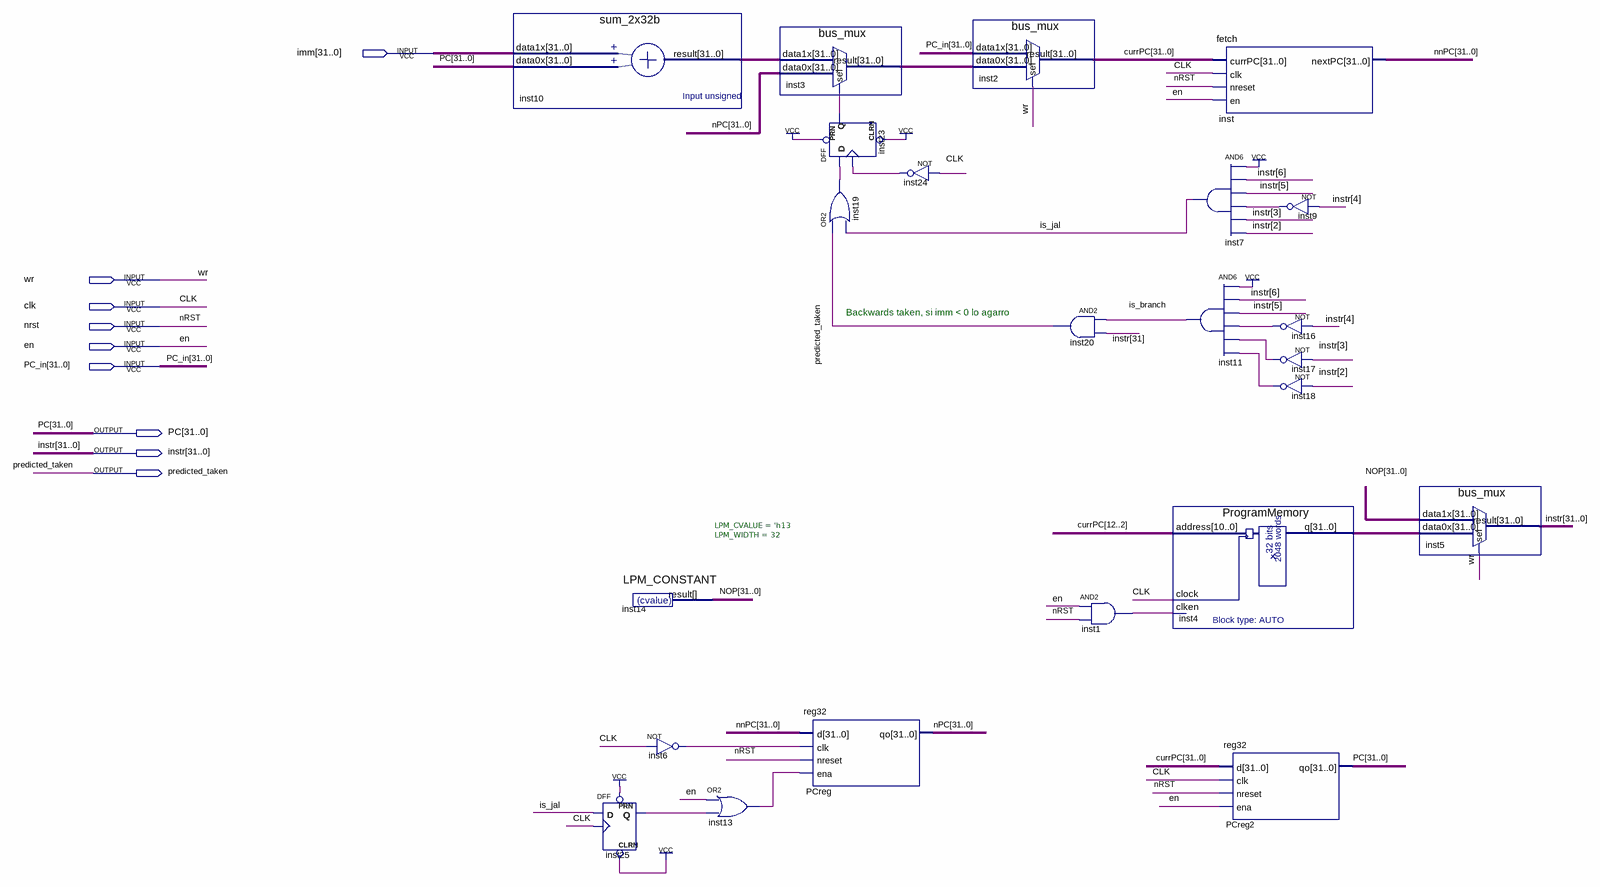
[diagram p0: schematic sheet]
// Quartus schematic IFU.bdf as structural Verilog: 23 symbols, 9 pins
module IFU (
  input  [31:0] imm,
  input  wr,
  input  clk,
  input  nrst,
  input  en,
  input  [31:0] PC_in,
  output [31:0] PC,
  output [31:0] instr,
  output predicted_taken
);

  wire inst1_out, inst6_out, inst9_out, inst13_out, inst16_out, inst17_out, inst18_out, inst19_out, inst23_q,
       inst24_out, inst25_q, is_branch, is_jal;
  wire [31:0] currPC, inst3_result, inst4_q, inst10_result, nnPC, NOP, nPC;

  sum_2x32b inst10 (.data1x(imm), .data0x(PC), .result(inst10_result));
  LPM_CONSTANT #(.LPM_CVALUE('h13), .LPM_WIDTH(32)) inst14 (.result(NOP));
  DFF inst25 (.CLRN(1'b1), .CLK(clk), .D(is_jal), .PRN(1'b1), .Q(inst25_q));
  not inst6 (inst6_out, clk);
  or inst13 (inst13_out, en, inst25_q);
  bus_mux inst3 (.data1x(inst10_result), .data0x(nPC), .sel(inst23_q), .result(inst3_result));
  reg32 PCreg (.d(nnPC), .clk(inst6_out), .nreset(nrst), .ena(inst13_out), .qo(nPC));
  DFF inst23 (.CLRN(1'b1), .CLK(inst24_out), .D(inst19_out), .PRN(1'b1), .Q(inst23_q));
  or inst19 (inst19_out, predicted_taken, is_jal);
  not inst24 (inst24_out, clk);
  bus_mux inst2 (.data1x(PC_in), .data0x(inst3_result), .sel(wr), .result(currPC));
  and inst20 (predicted_taken, is_branch, instr[31]);
  and inst1 (inst1_out, en, nrst);
  ProgramMemory inst4 (.address(currPC[12:2]), .clock(clk), .clken(inst1_out), .q(inst4_q));
  fetch inst (.currPC(currPC), .clk(clk), .nreset(nrst), .en(en), .nextPC(nnPC));
  and inst7 (is_jal, 1'b1, instr[6], instr[5], inst9_out, instr[3], instr[2]);
  and inst11 (is_branch, 1'b1, instr[6], instr[5], inst16_out, inst17_out, inst18_out);
  reg32 PCreg2 (.d(currPC), .clk(clk), .nreset(nrst), .ena(en), .qo(PC));
  not inst9 (inst9_out, instr[4]);
  not inst16 (inst16_out, instr[4]);
  not inst17 (inst17_out, instr[3]);
  not inst18 (inst18_out, instr[2]);
  bus_mux inst5 (.data1x(NOP), .data0x(inst4_q), .sel(wr), .result(instr));

  // Notes on the sheet:
  //   Backwards taken, si imm < 0 lo agarro
endmodule
